# Altium schematic sheet B3F1000.SchDoc
size A; SheetNumber: 7; SheetTotal: 8
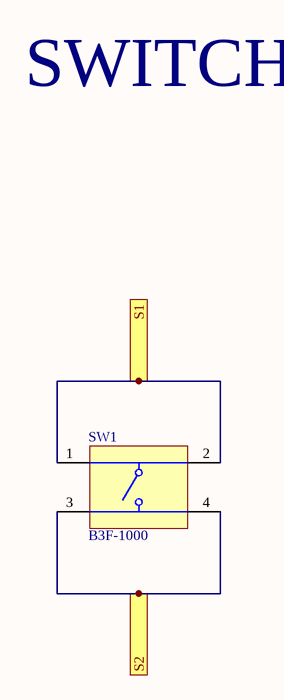
[diagram p0: B3F1000.SchDoc]

## Parts
SW1  B3F-1000  [OMRON-B3F-1000-4_V]

## Ports
S1 (see mainsheet[2C]), S2 (see mainsheet[2D])

## Nets
S1: SW1.1 SW1.2 ; port S1
S2: SW1.3 SW1.4 ; port S2

## Notes on the sheet
- SWITCH

## Library data of the parts
SW1 = CMP-1677-00002-1: Tactile Switch, SPST-NO, 0.05 A, 5 to 24 V, -25 to 70 degC, 4-Pin THD, RoHS, Bulk; Shielding: Shielded; Gender: Female; Capacitance: -45 f; Voltage Rating: 150 V; Current Rating: 1.5 A; Radiation Hardening: No; Contact Plating: Gold; Height: 14.99 mm; Min Operating Temperature: -40 degC; Packaging: Tray; ComponentLink2Description: Datasheet; ComponentLink1URL: http://www.omron.com/; Lead Pitch: 1.27 mm; RoHSCompliant: true; Pins: 8; PackageReference: B3F-1000; Width: 25.4 mm; Contact Material: Brass; ComponentLink2URL: http://www.omron.com/ecb/products/pdf/en-b3f.pdf; PackageDescription: 4-Pin Through Hole Device, Body 6 x 6 mm; DatasheetVersion: Jan-15; ComponentLink1Description: Manufacturer URL; Package Quantity: 1080; Mount: Through Hole; Length: 18.34 mm; Max Operating Temperature: 70 degC